# Altium project iCEstick_extension.PrjPcb
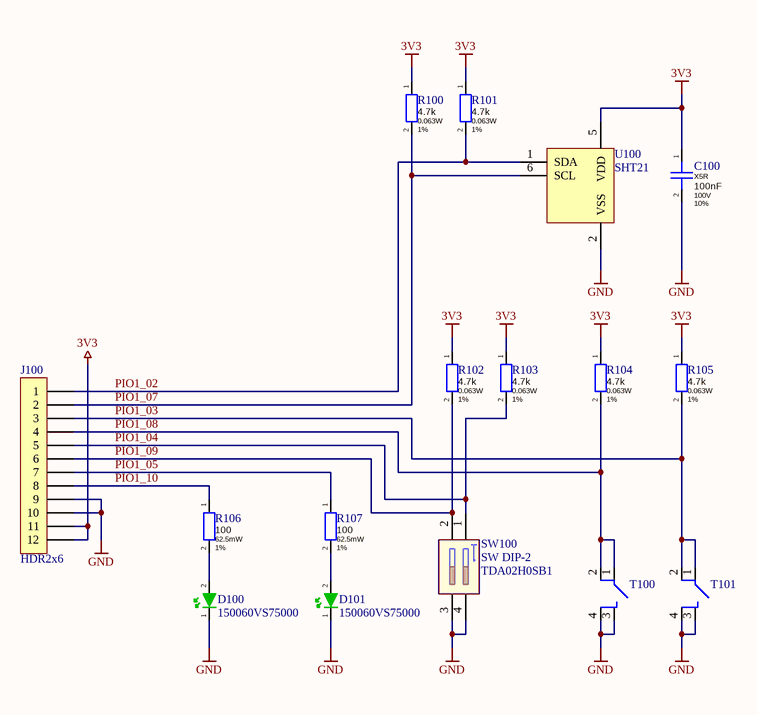
[diagram p0: 01 - Peripheral.SchDoc]
1 sheet, 16 parts. Net scope: global (net labels, ports and power ports of the same name join across sheets).
Board file: iCEstick_extension.PcbDoc

## Sheet 01 - Peripheral.SchDoc: Peripheral
size A4; Author: Sinan Uyan; DrawnBy: Sinan Uyan; DocumentNumber: 1; Revision: 1.0; SheetNumber: 1; SheetTotal: 1

### Parts
C100  Dielectric: X5R  Capacitance: 100nF  Voltage Rating: 100V  Tolerance: 10%  [CAPC0402(1005)60_L]  (hidden comment: GRM155R62A104KE14D)
D100  150060VS75000  [0603 LED pcb]
D101  150060VS75000  [0603 LED pcb]
J100  HDR2x6  [HDR2x6]
R100  Resistance: 4.7k  Power Rating: 0.063W  Tolerance: 1%  [RESC0402(1005)_L]  (hidden comment: RMCF0402FT4K70)
R101  Resistance: 4.7k  Power Rating: 0.063W  Tolerance: 1%  [RESC0402(1005)_L]  (hidden comment: RMCF0402FT4K70)
R102  Resistance: 4.7k  Power Rating: 0.063W  Tolerance: 1%  [RESC0402(1005)_L]  (hidden comment: RMCF0402FT4K70)
R103  Resistance: 4.7k  Power Rating: 0.063W  Tolerance: 1%  [RESC0402(1005)_L]  (hidden comment: RMCF0402FT4K70)
R104  Resistance: 4.7k  Power Rating: 0.063W  Tolerance: 1%  [RESC0402(1005)_L]  (hidden comment: RMCF0402FT4K70)
R105  Resistance: 4.7k  Power Rating: 0.063W  Tolerance: 1%  [RESC0402(1005)_L]  (hidden comment: RMCF0402FT4K70)
R106  Resistance: 100  Power Rating: 62.5mW  Tolerance: 1%  [RESC0402(1005)_L]  (hidden comment: RC0402FR-07100RL)
R107  Resistance: 100  Power Rating: 62.5mW  Tolerance: 1%  [RESC0402(1005)_L]  (hidden comment: RC0402FR-07100RL)
SW100  SW DIP-2  Manufacturer_Part_Number: TDA02H0SB1  [SW_TDA02]
T100  PTS645SK43SMTR92LFS  [PTS645SM43SMTR92 LFS - duplicate]  (value not drawn)
T101  PTS645SK43SMTR92LFS  [PTS645SM43SMTR92 LFS - duplicate]  (value not drawn)
U100  SHT21  [SHT2x_DFN6]

### Nets
3V3: C100.1 J100.11 J100.12 R100.1 R101.1 R102.1 R103.1 R104.1 R105.1 U100.5(VDD)
GND: C100.2 D100.1 D101.1 J100.9 J100.10 SW100.3(B2) SW100.4(B1) T100.3 T100.4 T101.3 T101.4 U100.2(VSS)
PIO1_02: J100.1 R101.2 U100.1(SDA)
PIO1_03: J100.3 R105.2 T101.1 T101.2
PIO1_04: J100.5 R103.2 SW100.1(A1)
PIO1_05: J100.7 R107.1
PIO1_07: J100.2 R100.2 U100.6(SCL)
PIO1_08: J100.4 R104.2 T100.1 T100.2
PIO1_09: J100.6 R102.2 SW100.2(A2)
PIO1_10: J100.8 R106.1
NetD100_2: D100.2 R106.2
NetD101_2: D101.2 R107.2

### Library data of the parts
C100 = CMP-00636-01: 0.1µF ±10% 100V Ceramic Capacitor X5R 0402 (1005 Metric); Manufacturer: Murata Electronics; RoHS Compliant: Yes; Mount: Surface Mount; Max Operating Temperature: 85°C; Min Operating Temperature: -55°C; Supplier Part Number 1: 490-10458-1-ND; Case/Package: 0402; Length: 0.039inch; Manufacturer Part Number: GRM155R62A104KE14D; Termination: SMD/SMT; Thickness: 0.022inch; ComponentLink1Description: Datasheet; Packaging: Tape and Reel; Height: 0.5mm; Package Quantity: 10000; Supplier 1: Digi-Key; Case Code (Imperial): 0402; Lead Free: Lead Free; Case Code (Metric): 1005; Voltage Rating (DC): 100V; Width: 0.5mm; Weight: 0.000212oz; REACH SVHC: No SVHC
D100 D101 = CMP-00024-A.5: Green 570nm LED Indication - Discrete 2V 0603 (1608 Metric); Manufacturer: Wurth Electronics; Test Current: 20mA; Viewing Angle: 140°; Luminous Intensity: 40mcd; Forward Current: 30mA; Lens Style: Clear,Rectangular; Package Quantity: 1; Supplier Part Number 1: 732-4980-1-ND; ComponentLink2URL: https://datasheet.ciiva.com/29279/759431-da-01-en-chipled-0603-w-kl-h-gruen-150060vs7500-29279199.pdf; REACH SVHC: Unknown; Supplier Part Number: 732-4980-1-ND; Colour: Green; Min Operating Temperature: -40°C; ComponentLink1Description: 150060vs75000-23843249.pdf; Case Code (Metric): 1608; ComponentLink5URL: https://datasheet.ciiva.com/29562/150060vs75000-29562919.pdf; Dominant Wavelength: 570nm; Forward Voltage: 2V; ComponentLink1URL: https://datasheet.ciiva.com/23843/150060vs75000-23843249.pdf; Case Code (Imperial): 0603; ComponentLink5Description: 150060vs75000-29562919.pdf; Wavelength: 570nm; Manufacturer Part Number: 150060VS75000; ComponentLink7URL: https://katalog.we-online.de/led/datasheet/150060VS75000.pdf; Height: 0.7mm; ComponentLink6URL: https://datasheet.ciiva.com/29562/150060vs75000-29562921.pdf; Case/Package: 0603; ComponentLink3Description: 150060vs75000-eng-tds-48430043.pdf; ComponentLink6Description: 150060vs75000-29562921.pdf; ComponentLink4URL: https://datasheet.ciiva.com/29562/150060vs75000-29562920.pdf; ComponentLink3URL: https://datasheet.ciiva.com/48430/150060vs75000-eng-tds-48430043.pdf; ComponentLink7Description: Datasheet; Supplier 1: Digi-Key; Width: 0.8mm; ComponentLink4Description: 150060vs75000-29562920.pdf; Packaging: Tape and Reel; Max Operating Temperature: 85°C; Supplier: Digi-Key; ComponentLink2Description: 759431-da-01-en-chipled-0603-w-kl-h-gruen-150060vs7500-29279199.pdf; Length: 1.6mm
J100 = HDR2x6-02: 2x6 Pin Header, 2.54mm; Properties: 2x6 Pin Terminal Header, 2.54mm
R100-R105 = CMP-00490-01: 4.7 kOhms ±1% 0.063W, 1/16W Chip Resistor 0402 (1005 Metric) Automotive AEC-Q200 Thick Film; Manufacturer: Stackpole Electronics Inc; Max Power Dissipation: 63mW; Temperature Coefficient: 100ppm/°C; Case Code (Metric): 1005; Case Code (Imperial): 0402; Min Operating Temperature: -55°C; Supplier Part Number 1: RMCF0402FT4K70CT-ND; Radiation Hardening: No; Width: 0.02inch; Depth: 0.5mm; Supplier 1: Digi-Key; Case/Package: 0402; Length: 1mm; Lead Free: Lead Free; Height: 0.016inch; Max Operating Temperature: 155°C; Features: Automotive AEC-Q200; Number of Terminations: 2; Resistor Type: Thick Film; Contact Plating: Tin,Matte; Military Standard: Not; Manufacturer Part Number: RMCF0402FT4K70; Mount: Surface Mount; Packaging: Tape and Reel; ComponentLink1Description: Datasheet
R106 R107 = CMP-00556-01: 100 Ohms ±1% 0.063W, 1/16W Chip Resistor 0402 (1005 Metric)  Thick Film; Manufacturer: Yageo; Voltage Rating (DC): 50V; Max Power Dissipation: 63mW; Temperature Coefficient: 100ppm/°C; Max Operating Temperature: 155°C; ComponentLink1Description: Datasheet; Military Standard: Not; Case Code (Metric): 1005; Technology: THICK FILM; Size Code: 0402; Resistance Tolerance: 1%; Case/Package: 0402; Construction: Rectangular; Features: Moisture Resistant; Series: RC; Supplier 1: Digi-Key; Number of Terminations: 2; Case Code (Imperial): 0402; Manufacturer Part Number: RC0402FR-07100RL; Supplier Part Number 1: 311-100LRCT-ND; Depth: 0.5mm; Packaging: Tape and Reel; Number of Pins: 2; Min Operating Temperature: -55°C; Width: 0.5mm; Termination: SMD/SMT; REACH SVHC: No SVHC; Resistor Type: Thick Film; Voltage Rating: 50V; Height: 0.32mm; Length: 1mm; Lead Free: Lead Free
SW100 = CMP-001-0045-01: SWITCH DIP 2POS HALF PITCH 24V; Manufacturer: C&K Components; Project: CCWMX6_SBC board; Internal_ID: 1001500; Area: 34.3; Digi_PN: 22000060; Component_Life_Cycle_State: Reviewed; Note: 22000296 = Digi No. for GE WDNU; RoHS: 1; ComponentLink4Description: Manufacturer Alt 3 datasheet; Package_Type: SMT; Height: 2.3; Symbol: SW DIP-2; Designator: SW DIP-2; Component Name: SW DIP-2; ComponentLink1Description: Manufacturer datasheet; ComponentLink2Description: Manufacturer Alt 1 datasheet; Pin Count: 4; ComponentLink1URL: //msp-file/public/Datasheet Repository/C&K Components/22000060.pdf; ComponentLink3Description: Manufacturer Alt 2 datasheet; Part_Type: Switch
T100 T101 = CMP-00280-01: SWITCH TACTILE SPST-NO 0.05A 12V; Manufacturer: C&K; Illumination Type: Non-Illuminated,Illuminated; Switch Function: Off-Mom; Throw Configuration: SPST; Mechanical Life: 100000Cycles; Actuator Material: Nylon,Polyamide; Current Rating: 50mA; Color: Black; Operating Force: 260gf; Actuator Type: Standard; Max Voltage Rating (DC): 12V; Mount: Surface Mount; REACH SVHC: No SVHC; Supplier Part Number 1: CKN9084CT-ND; Contact Plating: Silver; ComponentLink1URL: pts645 (pdf, 412.458 KB); Case/Package: SMD/SMT; Supplier 1: Digi-Key; Orientation: Straight; Contact Material: Bronze; Termination: Gull Wing; Length: 6mm; Packaging: Tape and Reel; Depth: 9mm; Package Quantity: 1000; Voltage Rating (DC): 12V; Datasheet: pts645 (pdf, 412.458 KB); Lead Free: Lead Free; Max Operating Temperature: 60°C; Min Operating Temperature: -20°C; Manufacturer Part Number: PTS645SK43SMTR92 LFS; ComponentLink1Description: Datasheet; Max Current Rating: 50mA
U100 = SHT21-01: Hygrometer and Thermometer, I2C Bus; Manufacturer: SENSIRION; Manufacturer Part Number: SHT21; ComponentLink1URL: http://www.farnell.com/datasheets/1780639.pdf; Supplier 2: Farnell; ComponentLink1Description: http://www.farnell.com/datasheets/1780639.pdf; Supplier Part Number 2: 1855468; SchLibComponentName: SHT21; Supplier 3: Mouser; Supplier Part Number 3: 403-SHT21